# EAGLE design driver (EAGLE 9.0.1)
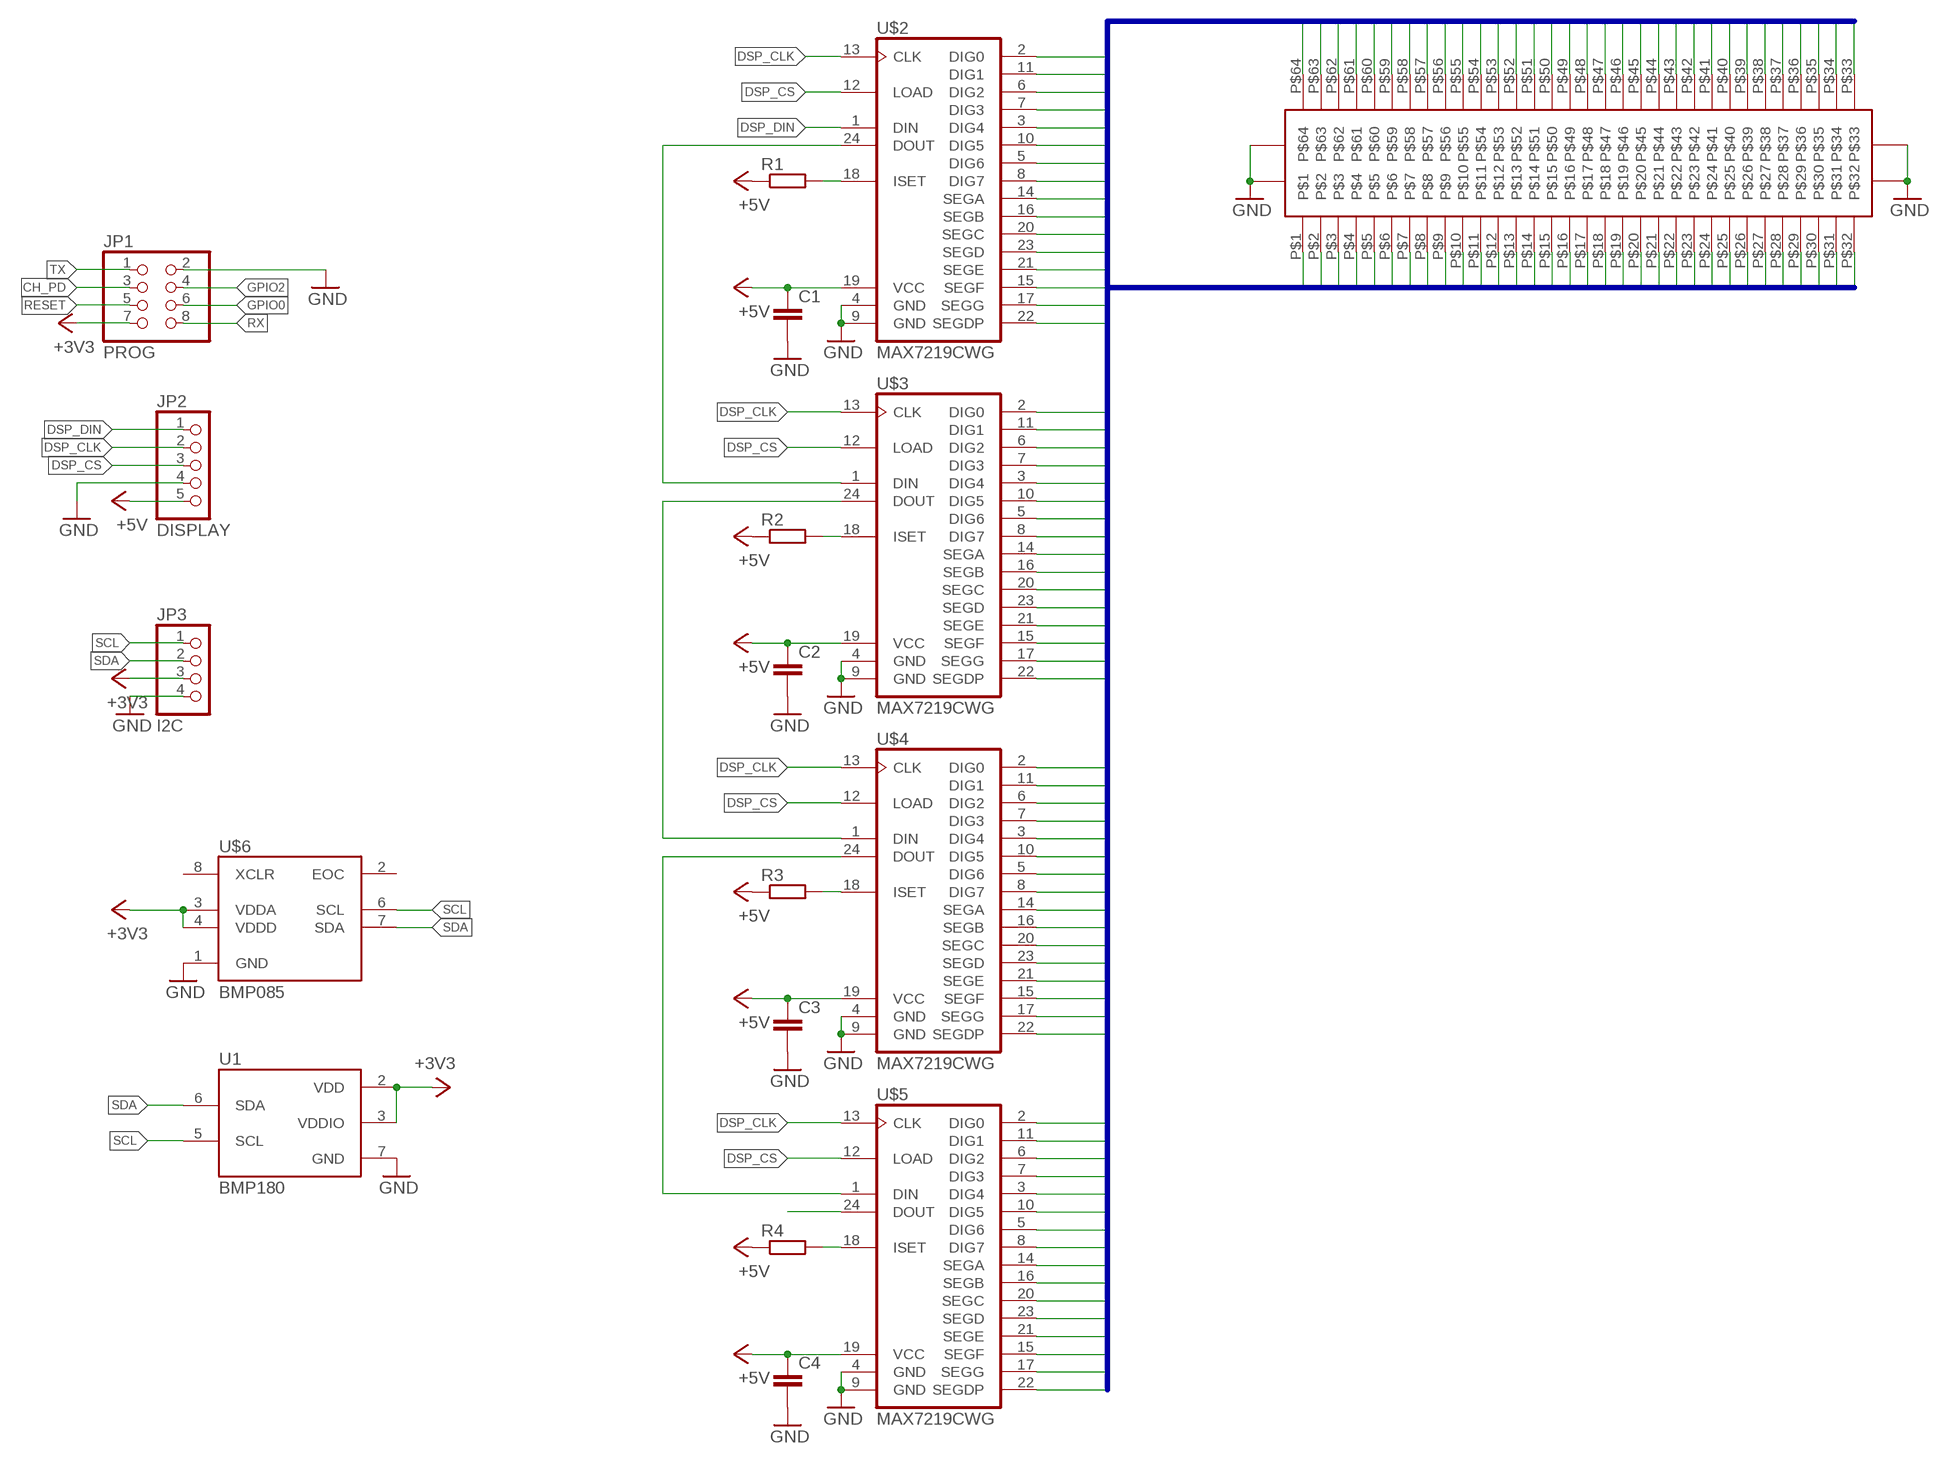
[diagram p0: schematic, sheet 1]

## Parts
C1  C-EUC0805  [C0805]
C2  C-EUC0805  [C0805]
C3  C-EUC0805  [C0805]
C4  C-EUC0805  [C0805]
JP1  PROG  PINHD-2X4  [2X04]
JP2  DISPLAY  PINHD-1X5  [1X05]
JP3  I2C  PINHD-1X4  [1X04]
R1  R-EU_R0805  [R0805]
R2  R-EU_R0805  [R0805]
R3  R-EU_R0805  [R0805]
R4  R-EU_R0805  [R0805]
U1  BMP180  [BMP180]
U$1  ANGLE_BOARD_CONNECTORTWO_SIDED  [TWO_SIDED]
U$2  MAX7219CWG  [SO24L]
U$3  MAX7219CWG  [SO24L]
U$4  MAX7219CWG  [SO24L]
U$5  MAX7219CWG  [SO24L]
U$6  BMP085  [BMP085]

## Nets
+3V3 [power]: JP1.7 JP3.3 U1.2(VDD) U1.3(VDDIO) U$6.3(VDDA) U$6.4(VDDD)
+5V [power]: C1.1 C2.1 C3.1 C4.1 JP2.5 R1.1 R2.1 R3.1 R4.1 U$2.19(VCC) U$3.19(VCC) U$4.19(VCC) U$5.19(VCC)
CH_PD: JP1.3
DSP_CLK: JP2.2 U$2.13(CLK) U$3.13(CLK) U$4.13(CLK) U$5.13(CLK)
DSP_CS: JP2.3 U$2.12(LOAD) U$3.12(LOAD) U$4.12(LOAD) U$5.12(LOAD)
DSP_DIN: JP2.1 U$2.1(DIN)
GND [gnd]: C1.2 C2.2 C3.2 C4.2 JP1.2 JP2.4 JP3.4 U1.7(GND) U$1.GND@1(GND) U$1.GND@2(GND) U$1.GND@3(GND) U$1.GND@4(GND) U$2.4(GND) U$2.9(GND) U$3.4(GND) U$3.9(GND) U$4.4(GND) U$4.9(GND) U$5.4(GND) U$5.9(GND) U$6.1(GND)
GPIO0: JP1.6
GPIO2: JP1.4
M1C1: U$1.P$64 U$2.2(DIG0)
M1C2: U$1.P$63 U$2.11(DIG1)
M1C3: U$1.P$62 U$2.6(DIG2)
M1C4: U$1.P$61 U$2.7(DIG3)
M1C5: U$1.P$60 U$2.3(DIG4)
M1C6: U$1.P$59 U$2.10(DIG5)
M1C7: U$1.P$58 U$2.5(DIG6)
M1C8: U$1.P$57 U$2.8(DIG7)
M1R1: U$1.P$1 U$2.14(SEGA)
M1R2: U$1.P$2 U$2.16(SEGB)
M1R3: U$1.P$3 U$2.20(SEGC)
M1R4: U$1.P$4 U$2.23(SEGD)
M1R5: U$1.P$5 U$2.21(SEGE)
M1R6: U$1.P$6 U$2.15(SEGF)
M1R7: U$1.P$7 U$2.17(SEGG)
M1R8: U$1.P$8 U$2.22(SEGDP)
M2C1: U$1.P$56 U$3.2(DIG0)
M2C2: U$1.P$55 U$3.11(DIG1)
M2C3: U$1.P$54 U$3.6(DIG2)
M2C4: U$1.P$53 U$3.7(DIG3)
M2C5: U$1.P$52 U$3.3(DIG4)
M2C6: U$1.P$51 U$3.10(DIG5)
M2C7: U$1.P$50 U$3.5(DIG6)
M2C8: U$1.P$49 U$3.8(DIG7)
M2R1: U$1.P$9 U$3.14(SEGA)
M2R2: U$1.P$10 U$3.16(SEGB)
M2R3: U$1.P$11 U$3.20(SEGC)
M2R4: U$1.P$12 U$3.23(SEGD)
M2R5: U$1.P$13 U$3.21(SEGE)
M2R6: U$1.P$14 U$3.15(SEGF)
M2R7: U$1.P$15 U$3.17(SEGG)
M2R8: U$1.P$16 U$3.22(SEGDP)
M3C1: U$1.P$48 U$4.2(DIG0)
M3C2: U$1.P$47 U$4.11(DIG1)
M3C3: U$1.P$46 U$4.6(DIG2)
M3C4: U$1.P$45 U$4.7(DIG3)
M3C5: U$1.P$44 U$4.3(DIG4)
M3C6: U$1.P$43 U$4.10(DIG5)
M3C7: U$1.P$42 U$4.5(DIG6)
M3C8: U$1.P$41 U$4.8(DIG7)
M3R1: U$1.P$17 U$4.14(SEGA)
M3R2: U$1.P$18 U$4.16(SEGB)
M3R3: U$1.P$19 U$4.20(SEGC)
M3R4: U$1.P$20 U$4.23(SEGD)
M3R5: U$1.P$21 U$4.21(SEGE)
M3R6: U$1.P$22 U$4.15(SEGF)
M3R7: U$1.P$23 U$4.17(SEGG)
M3R8: U$1.P$24 U$4.22(SEGDP)
M4C1: U$1.P$40 U$5.2(DIG0)
M4C2: U$1.P$39 U$5.11(DIG1)
M4C3: U$1.P$38 U$5.6(DIG2)
M4C4: U$1.P$37 U$5.7(DIG3)
M4C5: U$1.P$36 U$5.3(DIG4)
M4C6: U$1.P$35 U$5.10(DIG5)
M4C7: U$1.P$34 U$5.5(DIG6)
M4C8: U$1.P$33 U$5.8(DIG7)
M4R1: U$1.P$25 U$5.14(SEGA)
M4R2: U$1.P$26 U$5.16(SEGB)
M4R3: U$1.P$27 U$5.20(SEGC)
M4R4: U$1.P$28 U$5.23(SEGD)
M4R5: U$1.P$29 U$5.21(SEGE)
M4R6: U$1.P$30 U$5.15(SEGF)
M4R7: U$1.P$31 U$5.17(SEGG)
M4R8: U$1.P$32 U$5.22(SEGDP)
N$5: R1.2 U$2.18(ISET)
N$8: U$2.24(DOUT) U$3.1(DIN)
N$10: R2.2 U$3.18(ISET)
N$13: U$3.24(DOUT) U$4.1(DIN)
N$15: R3.2 U$4.18(ISET)
N$18: U$4.24(DOUT) U$5.1(DIN)
N$19: U$5.24(DOUT)
N$20: R4.2 U$5.18(ISET)
RESET: JP1.5
RX: JP1.8
SCL: JP3.1 U1.5(SCL) U$6.6(SCL)
SDA: JP3.2 U1.6(SDA) U$6.7(SDA)
TX: JP1.1
Unconnected: U$6.2(EOC) U$6.5(NC) U$6.8(XCLR)

## Buses
M1C1,M1C2,M1C3,M1C4,M1C5,M1C6,M1C7,M1C8,M1R1,M1R2,M1R3,M1R4,M1R5,M1R6,M1R7,M1R8,M2C1,M2C2,M2C3,M2C4,M2C5,M2C6,M2C7,M2C8,M2R1,M2R2,M2R3,M2R4,M2R5,M2R6,M2R7,M2R8,M3C1,M3C2,M3C3,M3C4,M3C5,M3C6,M3C7,M3C8,M3R1,M3R2,M3R3,M3R4,M3R5,M3R6,M3R7,M3R8,M4C1,M4C2,M4C3,M4C4,M4C5,M4C6,M4C7,M4C8,M4R1,M4R2,M4R3,M4R4,M4R5,M4R6,M4R7,M4R8

## Library data of the parts
C1-C4 = rcl:C-EU: CAPACITOR, European symbol; SPICEPREFIX: C
JP1 = pinhead:PINHD-2X4: PIN HEADER
JP2 = pinhead:PINHD-1X5: PIN HEADER
JP3 = pinhead:PINHD-1X4: PIN HEADER
R1-R4 = rcl:R-EU_: RESISTOR, European symbol; SPICEPREFIX: R
U1 = bmp180:BMP180: BOSCH BMP180 DIGITAL BAROMETRIC PRESSURE SENSOR Web page: http://www.bosch-sensortec.com/en/homepage/products_3/environmental_sensors_1/bmp180_1/bmp180 Datasheet: http://ae-bst.resource.bosch.com/media/products/dokumente/bmp180/BST-BMP180-DS000-09.pdf The BMP180 is the function compatible successor of the BMP085, a new generation of high precision digital pressure sensors for consumer applications. The ultra-low power, low voltage electronics of the BMP180 is optimized for use in mobile phones, PDAs, GPS navigation devices and outdoor equipment. With a low altitude noise of merely 0.25m at fast conversion time, the BMP180 offers superior performance. The I2C interface allows for easy system integration with a microcontroller. The BMP180 is based on piezo-resistive technology for EMC robustness, high accuracy and linearity as well as long term stability. Key features: - Temperature measurement included - I2C interface - Fully calibrated - Pb-free, halogen-free and RoHS compliant, - MSL 1 Basic specs: Pressure range: 300 to 1100hPa (+9000m to -500m relating to sea level) Supply voltage: 1.8 to 3.6V (VDD), 1.62V to 3.6V (VDDIO) Package: LGA package with metal lid Small footprint: 3.6mm x 3.8mm Super-flat: 0.93mm height Low power: 5µA at 1 sample / sec. in standard mode Low noise: 0.06hPa (0.5m) in ultra low power mode, 0.02hPa (0.17m) advanced resolution mode Typical applications: - Enhancement of GPS navigation (dead-reckoning, slope detection, etc.) - In- and out-door navigation - Leisure and sports - Weather forecast - Vertical velocity indication (rise/sink speed)
U$1 = interboard:ANGLE_BOARD_CONNECTOR: Angle interboard connector
U$2-U$5 = max7219:MAX7219CWG
U$6 = bmp085:BMP085: BMP085 Digital pressure sensor

## Net classes
0 default: width 0.3 mm
1 power: width 0.5 mm
2 gnd: width 0.5 mm

## Board
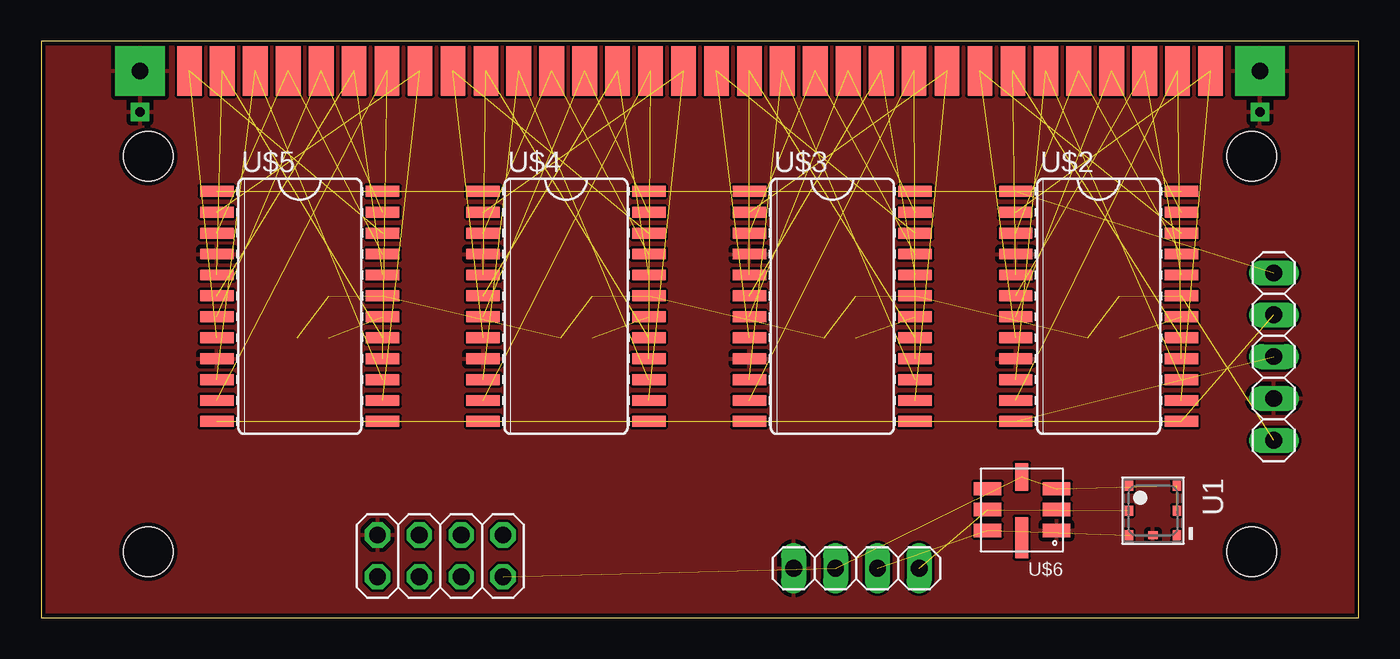
[diagram p1: board, top side]
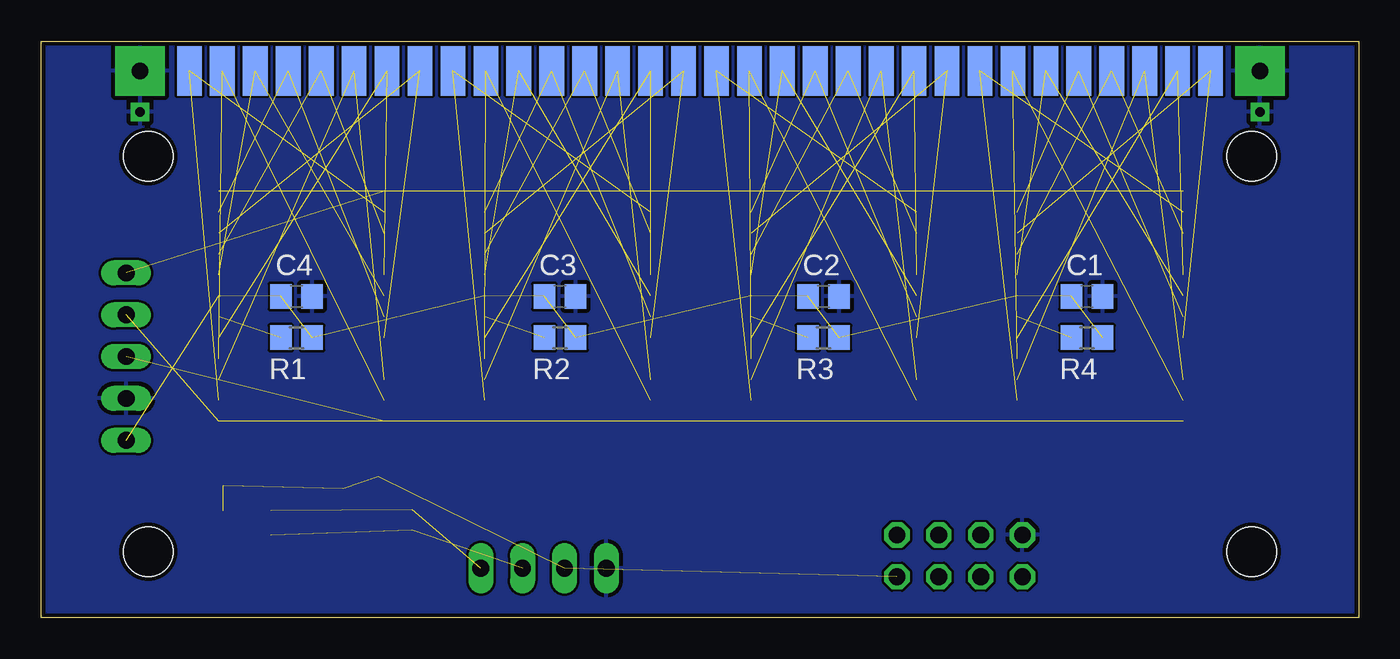
[diagram p2: board, bottom side, seen from below]

Size 80 x 35 mm. Coordinates in mm from the lower left corner, seen from the top.
Outline: 0,0 80,0 80,35 0,35 0,0
Copper layers (1*16): Top 0.035mm / dielectric 1.5mm / Bottom 0.035mm
Design rules "SeeedStudio_2layer_DRU_no_angle_20140221": minimum track width 6mil, minimum drill 12mil, track to track 6mil, track to pad 6mil, pad to pad 6mil, via to via 6mil, smd to smd 0mil, copper to edge 10mil, drill to drill 10mil, minimum pad ring 10mil, minimum via ring 6mil, stop-mask expansion 2mil, vias tented up to drill 100mil, thermal gap 10mil
Holes 3 mm at 6.5,4 6.5,28 73.5,4 73.5,28

### Footprints (pad centres in the part's own frame; a part is rotated, then mirrored left to right if it is on the bottom)
C0805 = smd 1.3 x 1.5: 1 -0.95,0; 2 0.95,0
2X04 = drill 1.016 octagon: 1 -3.81,-1.27; 2 -3.81,1.27; 3 -1.27,-1.27; 4 -1.27,1.27; 5 1.27,-1.27; 6 1.27,1.27; 7 3.81,-1.27; 8 3.81,1.27
1X05 = drill 1.016 long: 1 -5.08,0; 2 -2.54,0; 3 0,0; 4 2.54,0; 5 5.08,0
1X04 = drill 1.016 long: 1 -3.81,0; 2 -1.27,0; 3 1.27,0; 4 3.81,0
R0805 = smd 1.3 x 1.5: 1 -0.95,0; 2 0.95,0
BMP180 = smd 0.6 x 0.5: 1 1.5,1.45; 2 0,1.45; 3 -1.5,1.45; 4 -1.5,-1.45; 5 0,-1.45; 6 1.5,-1.45 | smd 0.5 x 0.6: 7 1.5,0
TWO_SIDED = drill 1 pad 3 square: GND@1 1.5,1.5; GND@2 69.5,1.5 | drill 0.6 square: GND@3 1.5,4; GND@4 69.5,4 | smd 1.5 x 3: P$1 4.5,1.5; P$2 6.5,1.5; P$3 8.5,1.5; P$4 10.5,1.5; P$5 12.5,1.5; P$6 14.5,1.5; P$7 16.5,1.5; P$8 18.5,1.5; P$9 20.5,1.5; P$10 22.5,1.5; P$11 24.5,1.5; P$12 26.5,1.5; P$13 28.5,1.5; P$14 30.5,1.5; P$15 32.5,1.5; P$16 34.5,1.5; P$17 36.5,1.5; P$18 38.5,1.5; P$19 40.5,1.5; P$20 42.5,1.5; P$21 44.5,1.5; P$22 46.5,1.5; P$23 48.5,1.5; P$24 50.5,1.5; P$25 52.5,1.5; P$26 54.5,1.5; P$27 56.5,1.5; P$28 58.5,1.5; P$29 60.5,1.5; P$30 62.5,1.5; P$31 64.5,1.5; P$32 66.5,1.5 | smd 1.5 x 3 bottom: P$33 66.5,1.5; P$34 64.5,1.5; P$35 62.5,1.5; P$36 60.5,1.5; P$37 58.5,1.5; P$38 56.5,1.5; P$39 54.5,1.5; P$40 52.5,1.5; P$41 50.5,1.5; P$42 48.5,1.5; P$43 46.5,1.5; P$44 44.5,1.5; P$45 42.5,1.5; P$46 40.5,1.5; P$47 38.5,1.5; P$48 36.5,1.5; P$49 34.5,1.5; P$50 32.5,1.5; P$51 30.5,1.5; P$52 28.5,1.5; P$53 26.5,1.5; P$54 24.5,1.5; P$55 22.5,1.5; P$56 20.5,1.5; P$57 18.5,1.5; P$58 16.5,1.5; P$59 14.5,1.5; P$60 12.5,1.5; P$61 10.5,1.5; P$62 8.5,1.5; P$63 6.5,1.5; P$64 4.5,1.5
SO24L = smd 0.66 x 2.032: 1 -6.985,-5.029; 2 -5.715,-5.029; 3 -4.445,-5.029; 4 -3.175,-5.029; 5 -1.905,-5.029; 6 -0.635,-5.029; 7 0.635,-5.029; 8 1.905,-5.029; 9 3.175,-5.029; 10 4.445,-5.029; 11 5.715,-5.029; 12 6.985,-5.029; 13 6.985,5.029; 14 5.715,5.029; 15 4.445,5.029; 16 3.175,5.029; 17 1.905,5.029; 18 0.635,5.029; 19 -0.635,5.029; 20 -1.905,5.029; 21 -3.175,5.029; 22 -4.445,5.029; 23 -5.715,5.029; 24 -6.985,5.029
BMP085 = smd 1.67 x 0.8: 1 -2.159,1.206; 2 -2.159,-0.064; 3 -2.159,-1.333; 5 2.032,-1.333; 6 2.032,-0.064; 7 2.032,1.206 | smd 0.8 x 1.67: 4 -0.04,-2.04 | smd 0.8 x 2.5: 8 -0.04,1.643

### Placement (x,y rotation side)
C1  16.5,19.5 0 bottom
C2  32.5,19.5 0 bottom
C3  48.5,19.5 0 bottom
C4  64.5,19.5 0 bottom
JP1  24.23,3.75 0 top
JP2  74.84,15.85 270 top
JP3  49.5,3 180 top
R1  64.5,17 180 bottom
R2  48.5,17 180 bottom
R3  32.5,17 180 bottom
R4  16.5,17 180 bottom
U1  67.5,6.5 270 top
U$1  75.5,34.7 180 top
U$2  64.2,18.9 270 top
U$3  48.03,18.9 270 top
U$4  31.87,18.9 270 top
U$5  15.7,18.9 270 top
U$6  59.5,6.5 180 top

### Tracks (layer width: path | path; a pad name or v marks a point on that pad's centre or on a via)
+3V3  (5 unrouted)
+5V  (12 unrouted)
DSP_CLK  (4 unrouted)
DSP_CS  (4 unrouted)
DSP_DIN  (1 unrouted)
GND
  pour Bottom: 0,0 80,0 80,35 0,35
  pour Top: 0,0 80,0 80,35 0,35
M1C1  (1 unrouted)
M1C2  (1 unrouted)
M1C3  (1 unrouted)
M1C4  (1 unrouted)
M1C5  (1 unrouted)
M1C6  (1 unrouted)
M1C7  (1 unrouted)
M1C8  (1 unrouted)
M1R1  (1 unrouted)
M1R2  (1 unrouted)
M1R3  (1 unrouted)
M1R4  (1 unrouted)
M1R5  (1 unrouted)
M1R6  (1 unrouted)
M1R7  (1 unrouted)
M1R8  (1 unrouted)
M2C1  (1 unrouted)
M2C2  (1 unrouted)
M2C3  (1 unrouted)
M2C4  (1 unrouted)
M2C5  (1 unrouted)
M2C6  (1 unrouted)
M2C7  (1 unrouted)
M2C8  (1 unrouted)
M2R1  (1 unrouted)
M2R2  (1 unrouted)
M2R3  (1 unrouted)
M2R4  (1 unrouted)
M2R5  (1 unrouted)
M2R6  (1 unrouted)
M2R7  (1 unrouted)
M2R8  (1 unrouted)
M3C1  (1 unrouted)
M3C2  (1 unrouted)
M3C3  (1 unrouted)
M3C4  (1 unrouted)
M3C5  (1 unrouted)
M3C6  (1 unrouted)
M3C7  (1 unrouted)
M3C8  (1 unrouted)
M3R1  (1 unrouted)
M3R2  (1 unrouted)
M3R3  (1 unrouted)
M3R4  (1 unrouted)
M3R5  (1 unrouted)
M3R6  (1 unrouted)
M3R7  (1 unrouted)
M3R8  (1 unrouted)
M4C1  (1 unrouted)
M4C2  (1 unrouted)
M4C3  (1 unrouted)
M4C4  (1 unrouted)
M4C5  (1 unrouted)
M4C6  (1 unrouted)
M4C7  (1 unrouted)
M4C8  (1 unrouted)
M4R1  (1 unrouted)
M4R2  (1 unrouted)
M4R3  (1 unrouted)
M4R4  (1 unrouted)
M4R5  (1 unrouted)
M4R6  (1 unrouted)
M4R7  (1 unrouted)
M4R8  (1 unrouted)
N$5  (1 unrouted)
N$8  (1 unrouted)
N$10  (1 unrouted)
N$13  (1 unrouted)
N$15  (1 unrouted)
N$18  (1 unrouted)
N$20  (1 unrouted)
SCL  (2 unrouted)
SDA  (2 unrouted)